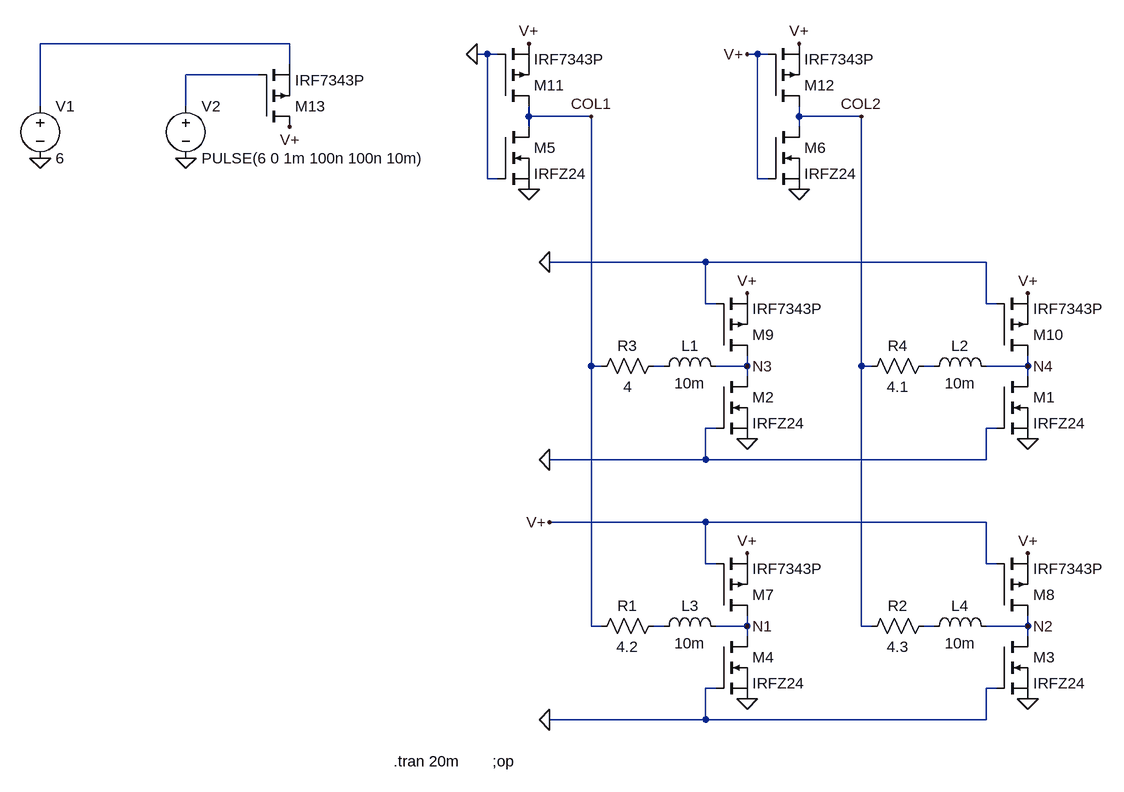
[diagram p0: schematic 7-Segment-Matrix-3.asc]
7-Segment-Matrix-3.asc, the LTspice schematic file:
Version 4
SHEET 1 880 816
WIRE -576 -304 -960 -304
WIRE -272 -288 -288 -288
WIRE -256 -288 -272 -288
WIRE 144 -288 128 -288
WIRE 160 -288 144 -288
WIRE -576 -272 -576 -304
WIRE -624 -256 -736 -256
WIRE -960 -208 -960 -304
WIRE -736 -208 -736 -256
WIRE -208 -192 -208 -208
WIRE -112 -192 -208 -192
WIRE 208 -192 208 -208
WIRE 304 -192 208 -192
WIRE -208 -176 -208 -192
WIRE 208 -176 208 -192
WIRE -272 -96 -272 -288
WIRE -256 -96 -272 -96
WIRE 144 -96 144 -288
WIRE 160 -96 144 -96
WIRE 64 32 -176 32
WIRE 496 32 64 32
WIRE 64 96 64 32
WIRE 80 96 64 96
WIRE 496 96 496 32
WIRE 512 96 496 96
WIRE -112 192 -112 -192
WIRE -96 192 -112 192
WIRE 0 192 -16 192
WIRE 128 192 128 176
WIRE 128 192 80 192
WIRE 304 192 304 -192
WIRE 320 192 304 192
WIRE 416 192 400 192
WIRE 560 192 560 176
WIRE 560 192 496 192
WIRE 128 208 128 192
WIRE 560 208 560 192
WIRE 80 288 64 288
WIRE 512 288 496 288
WIRE 64 336 64 288
WIRE 64 336 -176 336
WIRE 496 336 496 288
WIRE 496 336 64 336
WIRE 64 432 -176 432
WIRE 496 432 64 432
WIRE 64 496 64 432
WIRE 80 496 64 496
WIRE 496 496 496 432
WIRE 512 496 496 496
WIRE -112 592 -112 192
WIRE -96 592 -112 592
WIRE 0 592 -16 592
WIRE 128 592 128 576
WIRE 128 592 80 592
WIRE 304 592 304 192
WIRE 320 592 304 592
WIRE 416 592 400 592
WIRE 560 592 560 576
WIRE 560 592 496 592
WIRE 128 608 128 592
WIRE 560 608 560 592
WIRE 80 688 64 688
WIRE 512 688 496 688
WIRE 64 736 64 688
WIRE 64 736 -176 736
WIRE 496 736 496 688
WIRE 496 736 64 736
FLAG -208 -80 0
FLAG 208 -80 0
FLAG 128 304 0
FLAG 560 304 0
FLAG 128 704 0
FLAG 560 704 0
FLAG -960 -128 0
FLAG -576 -176 V+
FLAG -208 -304 V+
FLAG 208 -304 V+
FLAG 128 80 V+
FLAG 560 80 V+
FLAG 128 480 V+
FLAG 560 480 V+
FLAG -176 432 V+
FLAG -112 -192 COL1
FLAG 304 -192 COL2
FLAG 128 592 N1
FLAG 560 592 N2
FLAG 128 192 N3
FLAG 560 192 N4
FLAG 128 -288 V+
FLAG -176 32 0
FLAG -288 -288 0
FLAG -176 336 0
FLAG -176 736 0
FLAG -736 -128 0
SYMBOL nmos 512 208 R0
SYMATTR InstName M1
SYMATTR Value IRFZ24
SYMBOL nmos 80 208 R0
SYMATTR InstName M2
SYMATTR Value IRFZ24
SYMBOL nmos 512 608 R0
SYMATTR InstName M3
SYMATTR Value IRFZ24
SYMBOL nmos 80 608 R0
SYMATTR InstName M4
SYMATTR Value IRFZ24
SYMBOL res 0 576 R90
WINDOW 0 0 56 VBottom 2
WINDOW 3 32 56 VTop 2
SYMATTR InstName R1
SYMATTR Value 4.2
SYMBOL res 416 576 R90
WINDOW 0 0 56 VBottom 2
WINDOW 3 32 56 VTop 2
SYMATTR InstName R2
SYMATTR Value 4.3
SYMBOL res 0 176 R90
WINDOW 0 0 56 VBottom 2
WINDOW 3 32 56 VTop 2
SYMATTR InstName R3
SYMATTR Value 4
SYMBOL res 416 176 R90
WINDOW 0 0 56 VBottom 2
WINDOW 3 32 56 VTop 2
SYMATTR InstName R4
SYMATTR Value 4.1
SYMBOL nmos -256 -176 R0
SYMATTR InstName M5
SYMATTR Value IRFZ24
SYMBOL nmos 160 -176 R0
SYMATTR InstName M6
SYMATTR Value IRFZ24
SYMBOL pmos 80 576 M180
SYMATTR InstName M7
SYMATTR Value IRF7343P
SYMBOL pmos 512 576 M180
SYMATTR InstName M8
SYMATTR Value IRF7343P
SYMBOL pmos 80 176 M180
SYMATTR InstName M9
SYMATTR Value IRF7343P
SYMBOL pmos 512 176 M180
SYMATTR InstName M10
SYMATTR Value IRF7343P
SYMBOL pmos -256 -208 M180
SYMATTR InstName M11
SYMATTR Value IRF7343P
SYMBOL pmos 160 -208 M180
SYMATTR InstName M12
SYMATTR Value IRF7343P
SYMBOL voltage -960 -224 R0
WINDOW 123 0 0 Left 2
WINDOW 39 0 0 Left 2
SYMATTR InstName V1
SYMATTR Value 6
SYMBOL ind -16 208 R270
WINDOW 0 32 56 VTop 2
WINDOW 3 5 56 VBottom 2
SYMATTR InstName L1
SYMATTR Value 10m
SYMBOL ind 400 208 R270
WINDOW 0 32 56 VTop 2
WINDOW 3 5 56 VBottom 2
SYMATTR InstName L2
SYMATTR Value 10m
SYMBOL ind -16 608 R270
WINDOW 0 32 56 VTop 2
WINDOW 3 5 56 VBottom 2
SYMATTR InstName L3
SYMATTR Value 10m
SYMBOL ind 400 608 R270
WINDOW 0 32 56 VTop 2
WINDOW 3 5 56 VBottom 2
SYMATTR InstName L4
SYMATTR Value 10m
SYMBOL pmos -624 -176 M180
SYMATTR InstName M13
SYMATTR Value IRF7343P
SYMBOL voltage -736 -224 R0
WINDOW 123 0 0 Left 2
WINDOW 39 0 0 Left 2
SYMATTR InstName V2
SYMATTR Value PULSE(6 0 1m 100n 100n 10m)
TEXT -264 800 Left 2 !;op
TEXT -416 800 Left 2 !.tran 20m

The netlist it stands for:
* 7-Segment-Matrix-3.asc
M1 N4 0 0 0 IRFZ24
M2 N3 0 0 0 IRFZ24
M3 N2 0 0 0 IRFZ24
M4 N1 0 0 0 IRFZ24
R1 N005 COL1 4.2
R2 N006 COL2 4.3
R3 N003 COL1 4
R4 N004 COL2 4.1
M5 COL1 0 0 0 IRFZ24
M6 COL2 V+ 0 0 IRFZ24
M7 N1 V+ V+ V+ IRF7343P
M8 N2 V+ V+ V+ IRF7343P
M9 N3 0 V+ V+ IRF7343P
M10 N4 0 V+ V+ IRF7343P
M11 COL1 0 V+ V+ IRF7343P
M12 COL2 V+ V+ V+ IRF7343P
V1 N001 0 6
L1 N003 N3 10m
L2 N004 N4 10m
L3 N005 N1 10m
L4 N006 N2 10m
M13 V+ N002 N001 N001 IRF7343P
V2 N002 0 PULSE(6 0 1m 100n 100n 10m)
.model NMOS NMOS
.model PMOS PMOS
.lib standard.mos
;op
.tran 20m
.backanno
.end